# Altium schematic sheet LED_CH.SchDoc
size A4; DocumentNumber: 4; SheetNumber: 4; SheetTotal: 5
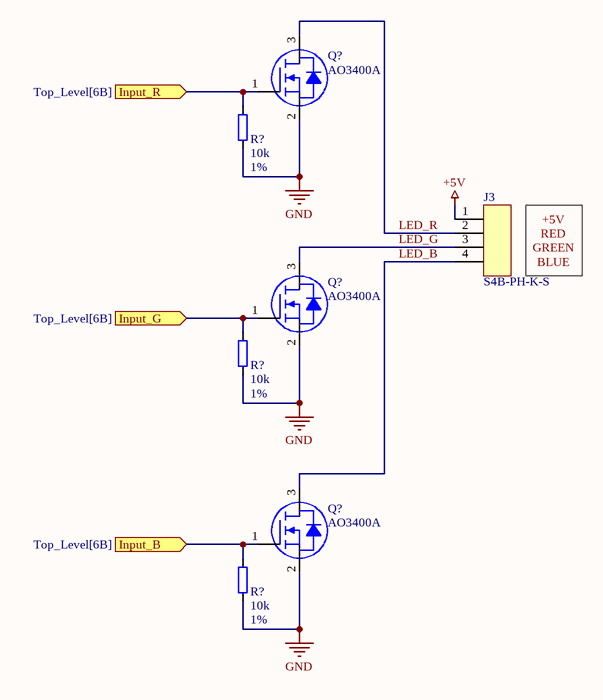
[diagram p0: LED_CH.SchDoc]

## Parts
(Parts that share a designator on the sheet are numbered #1, #2 ... from top to bottom, then left to right.)
J3  S4B-PH-K-S  [S4B-PH-K-S]
Q?#1  AO3400A  [SOT95P280X120-3N]
Q?#2  AO3400A  [SOT95P280X120-3N]
Q?#3  AO3400A  [SOT95P280X120-3N]
R?#1  Tolerance: 1%  [RESC1608X55N]  (hidden comment: 10k)
R?#2  Tolerance: 1%  [RESC1608X55N]  (hidden comment: 10k)
R?#3  Tolerance: 1%  [RESC1608X55N]  (hidden comment: 10k)

## Ports
Input_B (in, see Top_Level[6B]), Input_G (in, see Top_Level[6B]), Input_R (in, see Top_Level[6B])

## Nets
+5V: J3.1
GND: Q?#1.2(S) Q?#2.2(S) Q?#3.2(S) R?#1.1 R?#2.1 R?#3.1
Input_B: Q?#3.1(G) R?#3.2 ; port Input_B
Input_G: Q?#2.1(G) R?#2.2 ; port Input_G
Input_R: Q?#1.1(G) R?#1.2 ; port Input_R
LED_B: J3.4 Q?#3.3(D)
LED_G: J3.3 Q?#2.3(D)
LED_R: J3.2 Q?#1.3(D)

## Notes on the sheet
- +5V
- RED
- (near J3) GREEN
- BLUE
- Title:
- Author:
- Approved:
- Size:
- Date:
- Git Hash:
- A4
- Prj:
- SW Version:
- Variant:
- Edited:
- CONFIDENTIAL
- File:

## Library data of the parts
J3 = CMP-00003-3: JST (JAPAN SOLDERLESS TERMINALS) - S4B-PH-K-S (LF)(SN) - CONNECTOR, HEADER, 2MM, 4 POSITION, 1ROW; Voltage: 100V; Number of Contacts: 4; Current Rating: 2A; Connector Type: Male Pin; Contact Resistance: 10m; Insulation Resistance: 1G; Gender: Male; Termination: Solder; Contact Mating Length: 0.13inch; Orientation: Right Angle; Pitch: 2mm; Packaging: Bulk; Contact Material: Tin,Brass,Bronze; Flammability Rating: UL94 V-0; Fastening Type: Detent; REACH SVHC: No SVHC; Max Operating Temperature: 85°C; Width: 4.5mm; Voltage Rating: 100V; Voltage Rating (DC): 100V; Voltage Rating (AC): 100V; Lead Pitch: 2mm; Max Current Rating: 2A; Length: 9.9mm; Color: Natural,White; Height: 9.4mm; Current: 2A; Mount: Through Hole; Number of Poles: 4; Max Voltage Rating (DC): 100V; Contact Plating: Tin; Max Voltage Rating (AC): 100V; Lead Free: Lead Free; Number of Positions: 4; Number of Rows: 1; Housing Color: Natural; Min Operating Temperature: -25°C; Number of Pins: 4; Operating Supply Voltage: 100V; Working Voltage: 100V
Q?#1-Q?#3 = AO3400A: MOSFET N-CH 1G2S3D; MANUFACTURER: Alpha & Omega Semicon; Part Number: AO3400A; COMPONENTLINK1URL: https://datasheet.lcsc.com/lcsc/1811081213_Alpha---Omega-Semicon-AO3400A_C20917.pdf; COMPONENTLINK1DESCRIPTION: Datasheet; PACKAGE: SOT23-3; Part Status: Active
R?#1-R?#3 = WR06X1002FTL: Resistor; Manufacturer: Walsin Tech Corp; Temperature Coefficient: 100ppm; Power: 1/10 W; Min Temperature: -55°C; Max Temperature: 155°C; ComponentLink1URL: https://datasheet.lcsc.com/lcsc/2304140030_Walsin-Tech-Corp-WR06X1002FTL_C108449.pdf; ComponentLink1Description: Datasheet; Package: 0603; Resistance: 10k; Part Number: WR06X1002FTL; Part Status: Active